# Altium project SOM Board with RK3399.PrjPcb (part 4 of 5)

## Sheet [15]-Push_Button_&_SYS_LED.SchDoc: RK3399 SOM Board Design V1.0
size A4; Author: AVIRAL MISHRA; DocumentNumber: 17; SheetNumber: 17; SheetTotal: 21; PROJECT CODE: A_V1.0
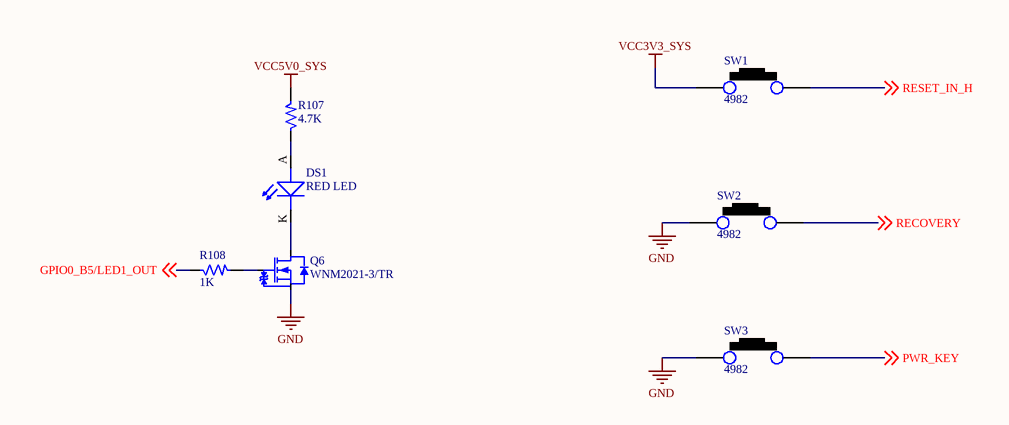
[diagram p16: [15]-Push_Button_&_SYS_LED.SchDoc]

### Parts
DS1  RED LED  [LED_0805]
Q6  WNM2021-3/TR  [SOT-323-3]
R107  4.7K  [RES_0402]
R108  1K  [RES_0402]
SW1  4982  [SW_177_39.3X77.7_SMD]
SW2  4982  [SW_177_39.3X77.7_SMD]
SW3  4982  [SW_177_39.3X77.7_SMD]

### Nets
GND: Q6.2(S) SW2.1 SW3.1
VCC3V3_SYS: SW1.1
VCC5V0_SYS: R107.2
GPIO0_B5/LED1_OUT: R108.1 ; off-sheet GPIO0_B5/LED1_OUT
PWR_KEY: SW3.2 ; off-sheet PWR_KEY
RECOVERY: SW2.2 ; off-sheet RECOVERY
RESET_IN_H: SW1.2 ; off-sheet RESET_IN_H
NetDS1_A: DS1.A(ANODE) R107.1
NetDS1_K: DS1.K(CATHODE) Q6.3(D)
NetQ6_1: Q6.1(G) R108.2

### Notes on the sheet
- TITLE:
- DOCUMENT NAME:
- SCALE 1:1
- This document is copyright of EsteemPCB and shall not be revealed, produced, copied, in whole or in part, nor
- PROJECT CODE:
- TEMPLATE:
- A4
- AUTHOR:
- Sheet
- of
- used for any purpose other than submitted.

### Library data of the parts
DS1 = LED_RED-2V-20mA-0805: Red 631nm LED Indication - Discrete 2V 0805 (2012 Metric); Manufacturer: Vishay Lite-On; Manufacturer Part Number: LTST-C171KRKT; Case/Package: 0805; Supplier-1: SP ROAD
Q6 = MOSFET-N_20V-820mA-SOT-323: N Channel 20V 820mA 850mV @ 250uA 310mΩ @ 550mA,4.5V 310mW SOT-323(SC-70) MOSFET RoHS /; Manufacturer: WILLSEMI(Will Semicon); Manufacturer Part Number: WNM2021-3/TR; Case/Package: SOT-323(SC-70); Supplier-1: LCSC
R107 = RES_4.7K-0.1W-1%-0402: 4.7 kOhms ±1% 0.1W, 1/10W Chip Resistor 0402 (1005 Metric) Automotive AEC-Q200 Thick Film /; Manufacturer: Panasonic Electronic Components; Manufacturer Part Number: ERJ-2RKF4701X; Case/Package: 0402; Supplier-1: Digikey
R108 = RES_1K-0.1W-1%-0402: 1 kOhms ±1% 0.1W, 1/10W Chip Resistor 0402 (1005 Metric) Anti-Sulfur Thin Film /; Manufacturer: Vishay Beyschlag/Draloric/BC Components; Manufacturer Part Number: MCS04020C1001FE000; Case/Package: 0402; Supplier-1: Digikey
SW1-SW3 = SW1_4982: Tactile Switch 3x4x2mm SMD 2-Pin; Manufacturer: NA; Manufacturer Part Number: NA; Case/Package: SMD; Supplier-1: Sunrom

## Sheet [16]-SP1_TYPEC_PWR_IN.SchDoc: RK3399 SOM Board Design V1.0
size A4; Author: AVIRAL MISHRA; DocumentNumber: 18; SheetNumber: 18; SheetTotal: 21; PROJECT CODE: A_V1.0
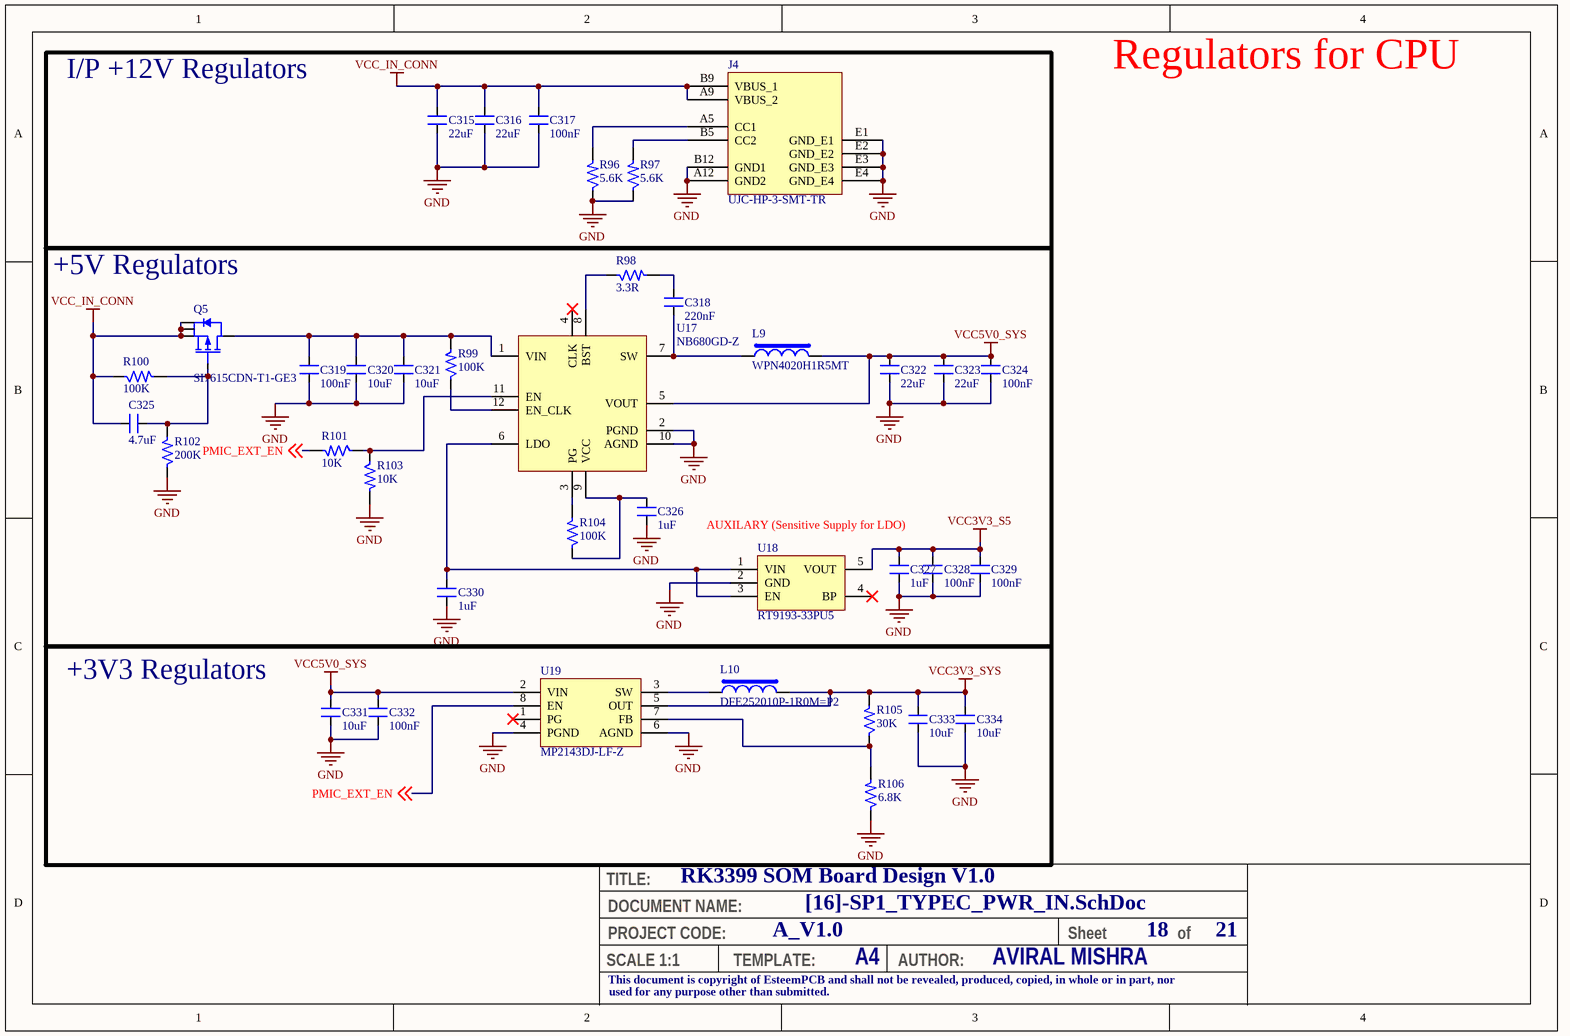
[diagram p17: [16]-SP1_TYPEC_PWR_IN.SchDoc]

### Parts
C315  22uF  [CAP_0603]
C316  22uF  [CAP_0603]
C317  100nF  [CAP_0402]
C318  220nF  [CAP_0402]
C319  100nF  [CAP_0402]
C320  10uF  [CAP_0402]
C321  10uF  [CAP_0402]
C322  22uF  [CAP_0603]
C323  22uF  [CAP_0603]
C324  100nF  [CAP_0402]
C325  4.7uF  [CAP_0402]
C326  1uF  [CAP_0402]
C327  1uF  [CAP_0402]
C328  100nF  [CAP_0402]
C329  100nF  [CAP_0402]
C330  1uF  [CAP_0402]
C331  10uF  [CAP_0402]
C332  100nF  [CAP_0402]
C333  10uF  [CAP_0402]
C334  10uF  [CAP_0402]
J4  UJC-HP-3-SMT-TR  [CON6_48.4_UJC-HP-3-SMT-TR]
L9  WPN4020H1R5MT  [IND_1616]
L10  DFE252010P-1R0M=P2  [IND_1008]
Q5  SI7615CDN-T1-GE3  [PowerPAK_1212-8_SMD]
R96  5.6K  [RES_0402]
R97  5.6K  [RES_0402]
R98  3.3R  [RES_0402]
R99  100K  [RES_0402]
R100  100K  [RES_0402]
R101  10K  [RES_0402]
R102  200K  [RES_0402]
R103  10K  [RES_0402]
R104  100K  [RES_0402]
R105  30K  [RES_0402]
R106  6.8K  [RES_0402]
U17  NB680GD-Z  [QFN-12_19_118X118_SMD]
U18  RT9193-33PU5  [SC70-5]
U19  MP2143DJ-LF-Z  [SOT23-8]

### Blocks framed on the sheet
I/P +12V Regulators: C315-C317 J4 R96 R97
+5V Regulators: C318-C330 L9 Q5 R98-R104 U17 U18
+3V3 Regulators: C331-C334 L10 R105 R106 U19

### Nets
GND: C315.1 C316.1 C317.1 C319.1 C320.1 C321.1 C322.1 C323.1 C324.1 C326.1 C327.1 C328.1 C329.1 C330.1 C331.1 C332.1 C333.1 C334.1 J4.A12(GND2) J4.B12(GND1) J4.E1(GND_E1) J4.E2(GND_E2) J4.E3(GND_E3) J4.E4(GND_E4) R96.1 R97.1 R102.1 R103.2 R106.1 U17.2(PGND) U17.10(AGND) U18.2(GND) U19.4(PGND) U19.6(AGND)
VCC3V3_S5: C327.2 C328.2 C329.2 U18.5(VOUT)
VCC3V3_SYS: C333.2 C334.2 L10.2 R105.2 U19.5(OUT)
VCC5V0_SYS: C322.2 C323.2 C324.2 C331.2 C332.2 L9.2 U17.5(VOUT) U19.2(VIN)
VCC_IN_CONN: C315.2 C316.2 C317.2 C325.1 J4.A9(VBUS_2) J4.B9(VBUS_1) Q5.1(S) Q5.2(S) Q5.3(S) R100.1
PMIC_EXT_EN: R101.2 U19.8(EN) ; off-sheet PMIC_EXT_EN
NetC318_1: C318.1 L9.1 U17.7(SW)
NetC318_2: C318.2 R98.2
NetC319_2: C319.2 C320.2 C321.2 Q5.5(D) R99.2 U17.1(VIN)
NetC325_2: C325.2 Q5.4(G) R100.2 R102.2
NetC326_2: C326.2 R104.1 U17.9(VCC)
NetC330_2: C330.2 U17.6(LDO) U18.1(VIN) U18.3(EN)
NetJ4_A5: J4.A5(CC1) R96.2
NetJ4_B5: J4.B5(CC2) R97.2
NetL10_1: L10.1 U19.3(SW)
NetR98_1: R98.1 U17.8(BST)
NetR99_1: R99.1 U17.12(EN_CLK)
NetR101_1: R101.1 R103.1 U17.11(EN)
NetR104_2: R104.2 U17.3(PG)
NetR105_1: R105.1 R106.2 U19.7(FB)

Not connected (* = marked no-connect by the designer): U17 4(CLK)*; U18 4(BP)*; U19 1(PG)*

### Notes on the sheet
- Regulators for CPU
- AUXILARY (Sensitive Supply for LDO)
- TITLE:
- DOCUMENT NAME:
- SCALE 1:1
- This document is copyright of EsteemPCB and shall not be revealed, produced, copied, in whole or in part, nor
- PROJECT CODE:
- TEMPLATE:
- A4
- AUTHOR:
- Sheet
- of
- used for any purpose other than submitted.

### Library data of the parts
C315 C316 C322 C323 = CAP_22uF-10V-20%-0603: 22µF ±20% 10V Ceramic Capacitor X5R 0603 (1608 Metric) /; Manufacturer: Murata Electronics; Manufacturer Part Number: GRM188R61A226ME15D; Case/Package: 0603; Supplier-1: Digikey
C317 C319 C324 C328 C329 C332 = CAP_100nF-25V-10%-0402: 0.1µF ±10% 25V Ceramic Capacitor X7R 0402 (1005 Metric) /; Manufacturer: Walsin Technology Corporation; Manufacturer Part Number: 0402B104K250CT; Case/Package: 0402; Supplier-1: Digikey
C318 = CAP_220nF-10V-10%-0402: 0.22µF ±10% 10V Ceramic Capacitor X7R 0402 (1005 Metric) /; Manufacturer: Samsung Electro-Mechanics; Manufacturer Part Number: CL05B224KP5NNNC; Case/Package: 0402; Supplier-1: Digikey
C320 C321 C331 C333 C334 = CAP_10uF-10V-20%-0402: 10µF ±20% 10V Ceramic Capacitor X5R 0402 (1005 Metric) /; Manufacturer Part Number: CL05A106MP5NUNC; Manufacturer: Samsung Electro-Mechanics; Case/Package: 0402; Supplier-1: Digikey
C325 = CAP_4.7uF-10V-10%-0402: 4.7µF ±10% 10V Ceramic Capacitor X5R 0402 (1005 Metric) /; Manufacturer: Samsung Electro-Mechanics; Manufacturer Part Number: CL05A475KP5NRNC; Case/Package: 0402; Supplier-1: Digikey
C326 C327 C330 = CAP_1uF-16V-10%-0402: 1µF ±10% 16V Ceramic Capacitor X5R 0402 (1005 Metric) /; Manufacturer: Knowles Novacap; Manufacturer Part Number: 0402BW105K160YT; Case/Package: 0402; Supplier-1: Digikey
J4 = CON-TYPEC_6X1-100-RA-TH: USB Connectors USB jack, C type, power only, 6 pin, horizonal, gold flash plating, surface mount, T&R; Manufacturer: CUI Devices; Manufacturer Part Number: UJC-HP-3-SMT-TR; Case/Package: TH; Supplier-1: Mouser
L9 = IND_1.5uH-6A-20%-SMD: Wire Wound SMD Power Inductors – WPN Series / Operating Temp. : -40℃~+125℃ (Including self-heating) /; Manufacturer: Sunlord; Mnaufcaturer Part Number: WPN4020H1R5MT; Case/Package: SMD; Supplier-1: NA
L10 = IND_1uH-3.8A-20%-1008: 1µH Shielded Wirewound Inductor 3.8A 54mOhm Max 1008 (2520 Metric) /; Manufacturer: Murata Electronics; Manufacturer Part Number: DFE252010P-1R0M=P2; Case/Package: 1008; Supplier-1: Digikey
Q5 = MOSFET-P_20V-35A-1212-8: P-Channel 20V 35A (Tc) 33W (Tc) Surface Mount PowerPAK® 1212-8 /; Manufacturer: Vishay Siliconix; Manufacturer Part Number: SI7615CDN-T1-GE3; Case/Package: PowerPAK® 1212-8; Supplier-1: Digikey
R96 R97 = RES_5.6K-0.1W-1%-0402: 5.6 kOhms ±1% 0.1W, 1/10W Chip Resistor 0402 (1005 Metric) Automotive AEC-Q200, Moisture Resistant Thick Film /; Manufacturer: KOA Speer Electronics, Inc.; Manufacturer Part Number: RK73H1ETTP5601F; Case/Package: 0402; Supplier-1: Digikey
R98 = RES_3.3R-0.1W-1%-0402: 3.3 Ohms ±1% 0.1W, 1/10W Chip Resistor 0402 (1005 Metric) Anti-Sulfur, Automotive AEC-Q200 Thick Film /; Manufacturer: Panasonic Electronic Components; Manufacturer Part Number: ERJ-U02F3R30X; Case/Package: 0402; Supplier-1: Digikey
R99 R100 R104 = RES_100K-0.1W-1%-0402: 100 kOhms ±1% 0.1W, 1/10W Chip Resistor 0402 (1005 Metric) Anti-Sulfur Thin Film /; Manufacturer: Vishay Beyschlag/Draloric/BC Components; Manufacturer Part Number: MCS04020C1003FE000; Case/Package: 0402; Supplier-1: Digikey
R101 R103 = RES_10K-0.1W-1%-0402: 10 kOhms ±1% 0.1W, 1/10W Chip Resistor 0402 (1005 Metric) Anti-Sulfur Thin Film /; Manufacturer: Vishay Beyschlag/Draloric/BC Components; Manufacturer Part Number: MCS04020C1002FE000; Case/Package: 0402; Supplier-1: Digikey
R102 = RES_200K-0.1W-1%-0402: 200 kOhms ±1% 0.1W, 1/10W Chip Resistor 0402 (1005 Metric) Automotive AEC-Q200 Thick Film /; Manufacturer: Panasonic Electronic Components; Manufacturer Part number: ERJ-2RKF2003X; Case/Package: 0402; Supplier-1: Digikey
R105 = RES_30K-0.1W-1%-0402: 30 kOhms ±1% 0.1W, 1/10W Chip Resistor 0402 (1005 Metric) Automotive AEC-Q200, Moisture Resistant Thick Film /; Manufacturer: KOA Speer Electronics, Inc.; Manufacturer Part Number: RK73H1ETTP3002F; Case/Package: 0402; Supplier-1: Digikey
R106 = RES_6.8K-0.1W-1%-0402: 6.8 kOhms ±1% 0.1W, 1/10W Chip Resistor 0402 (1005 Metric) Anti-Sulfur Thin Film /; Manufacturer Part Number: MCS04020C6801FE000; Manufacturer: Vishay Beyschlag/Draloric/BC Components; Case/Package: 0402; Supplier-1: Digikey
U17 = REG_3.3V-26V-8A-QFN-12: Switching Voltage Regulators 26V Fixed 3.3 V-8A Sync Buck Converter; Manufacturer: Monolithic Power Systems (MPS); Manufacturer Part Number: NB680GD-Z; Case/Package: QFN-12; Supplier-1: Mouser
U18 = REG_3.3V-5.5V-300mA-SC-70-5: SC-70-5 Dropout Regulators(LDO) RoHS; Manufacturer: Richtek Tech; Manufacturer Part Number: RT9193-33PU5; Case/Package: SC-70-5; Supplier-1: LCSC
U19 = REG_0.6~5V-5.5V-3A-TSOT-23-8: Switching Voltage Regulators 3A, 5.5V, 1.2MHz Sync Stp-Dwn Swtchr; Manufacturer: Monolithic Power Systems (MPS); Manufacturer Part Number: MP2143DJ-LF-Z; Case/Package: TSOT-23-8; Supplier-1: Mouser

## Sheet [17]-SP2_BUCKs_GPU_LOG_CPU-B.SchDoc: RK3399 SOM Board Design V1.0
size A3; Author: ABC; Organization: Altium Limited; Address1: L3, 12a Rodborough Rd; Address2: Frenchs Forest; Address3: NSW; Address4: Australia 2086; DocumentNumber: 19; SheetNumber: 19; SheetTotal: 21; PROJECT CODE: A_V1.0
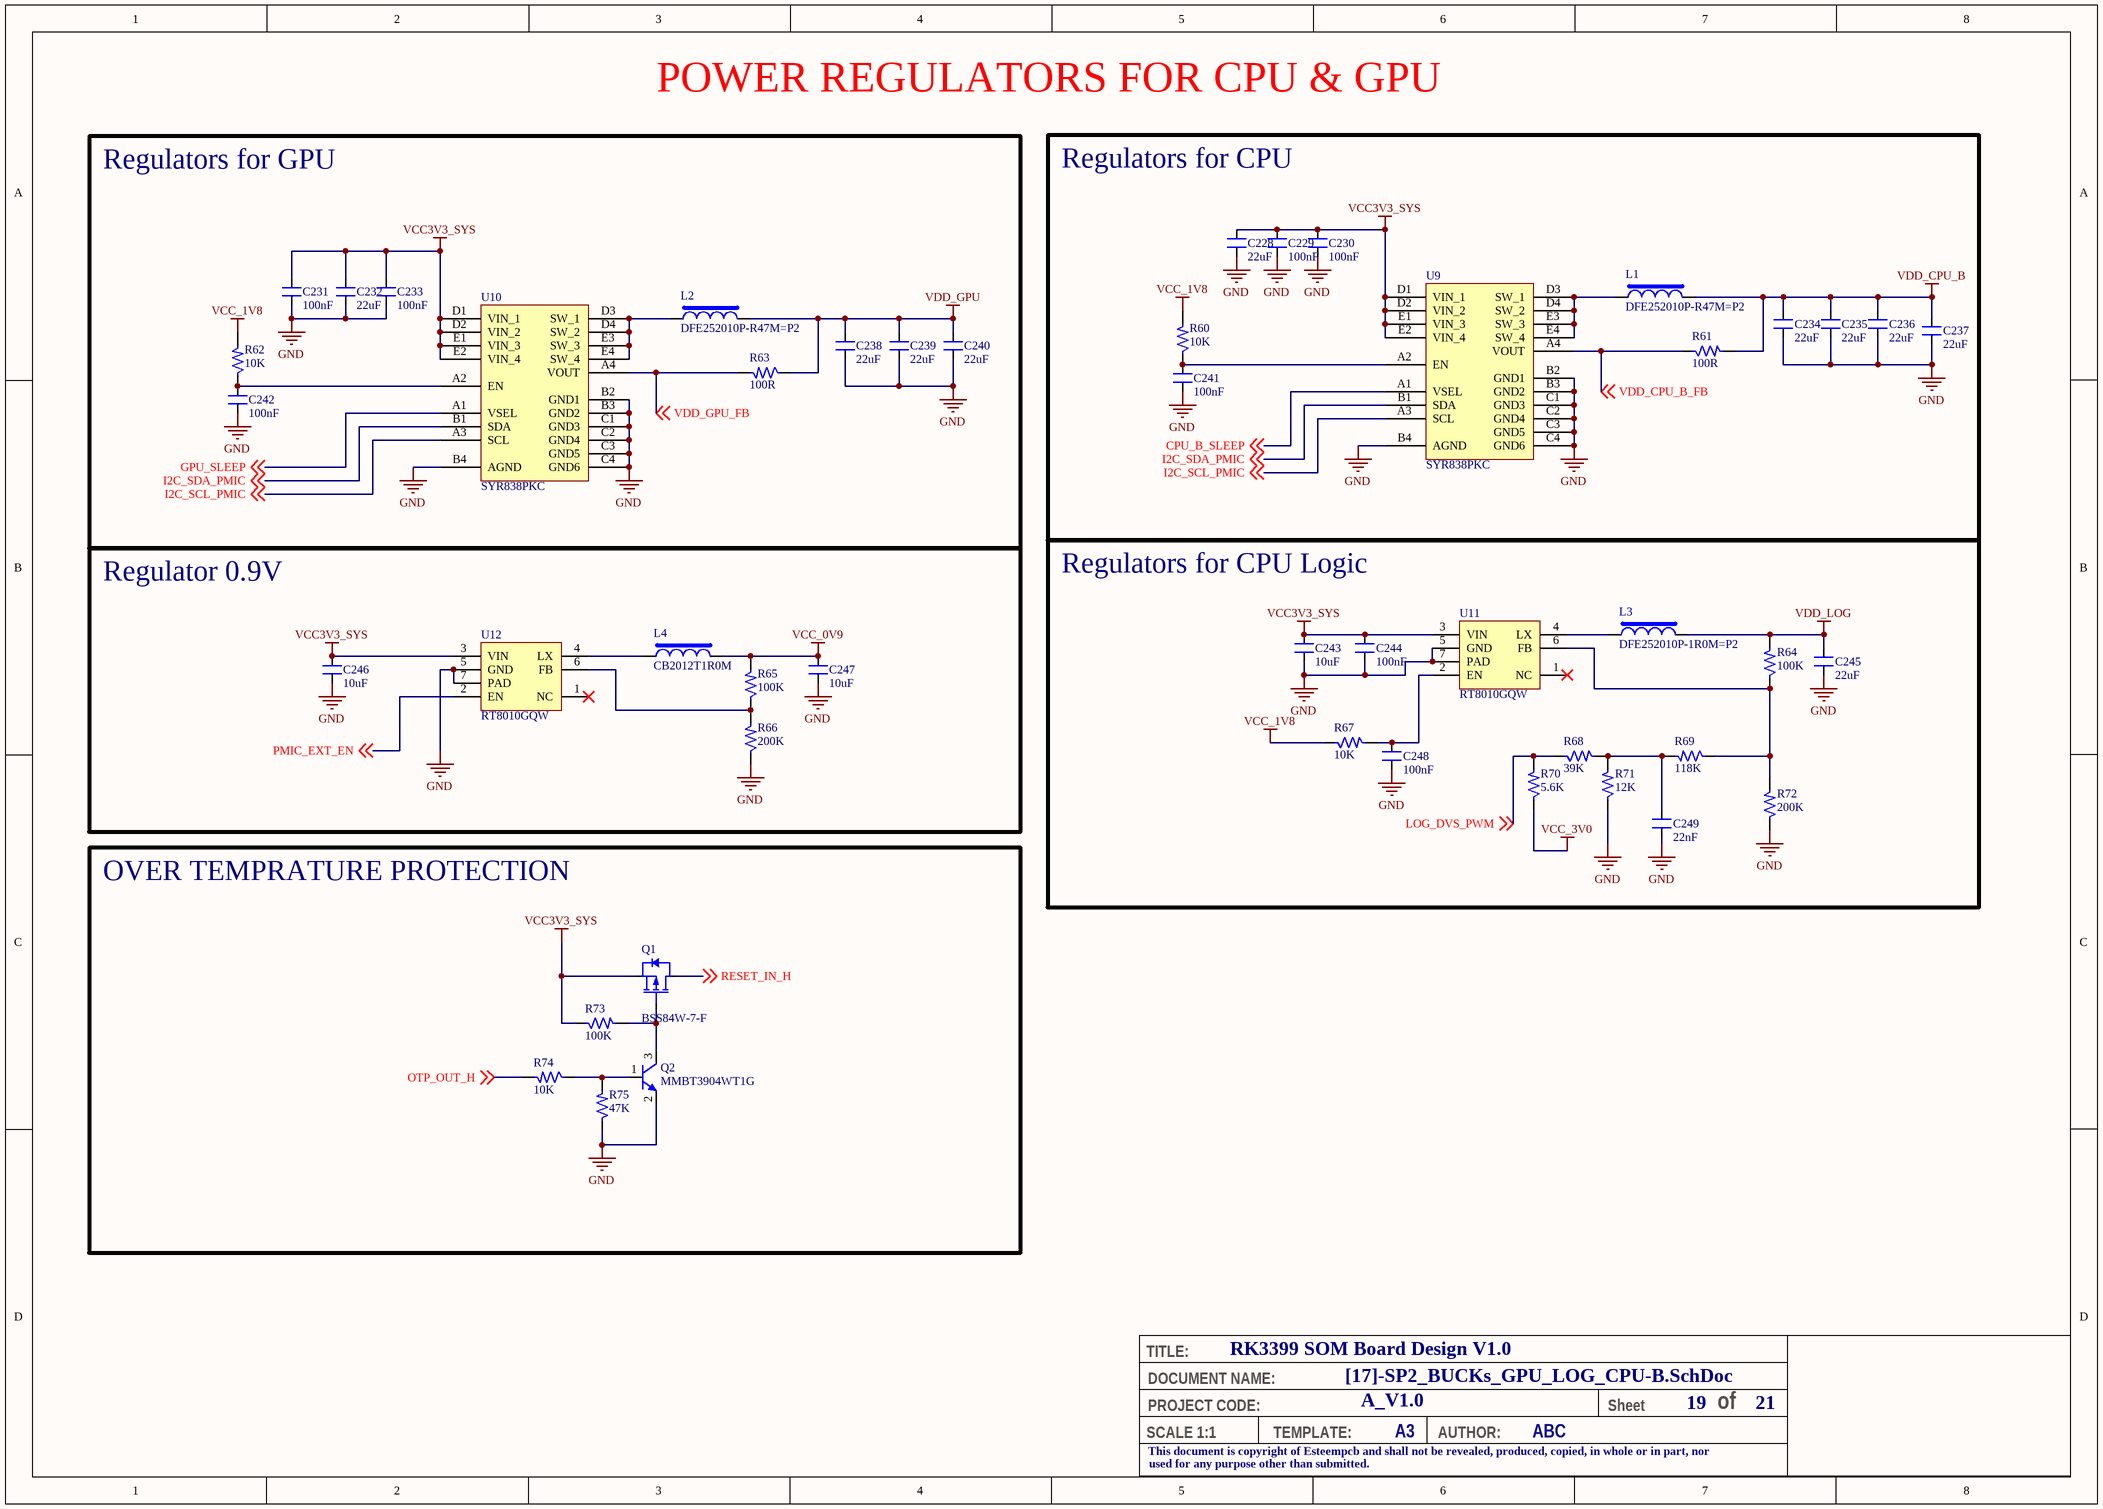
[diagram p18: [17]-SP2_BUCKs_GPU_LOG_CPU-B.SchDoc]

### Parts
C228  22uF  [CAP_0603]
C229  100nF  [CAP_0402]
C230  100nF  [CAP_0402]
C231  100nF  [CAP_0402]
C232  22uF  [CAP_0603]
C233  100nF  [CAP_0402]
C234  22uF  [CAP_0603]
C235  22uF  [CAP_0603]
C236  22uF  [CAP_0603]
C237  22uF  [CAP_0603]
C238  22uF  [CAP_0603]
C239  22uF  [CAP_0603]
C240  22uF  [CAP_0603]
C241  100nF  [CAP_0402]
C242  100nF  [CAP_0402]
C243  10uF  [CAP_0402]
C244  100nF  [CAP_0402]
C245  22uF  [CAP_0603]
C246  10uF  [CAP_0402]
C247  10uF  [CAP_0402]
C248  100nF  [CAP_0402]
C249  22nF  [CAP_0402]
L1  DFE252010P-R47M=P2  [IND_1008]
L2  DFE252010P-R47M=P2  [IND_1008]
L3  DFE252010P-1R0M=P2  [IND_1008]
L4  CB2012T1R0M  [IND_0805]
Q1  BSS84W-7-F  [SOT-323-3]
Q2  MMBT3904WT1G  [SOT-323-3]
R60  10K  [RES_0402]
R61  100R  [RES_0402]
R62  10K  [RES_0402]
R63  100R  [RES_0402]
R64  100K  [RES_0402]
R65  100K  [RES_0402]
R66  200K  [RES_0402]
R67  10K  [RES_0402]
R68  39K  [RES_0402]
R69  118K  [RES_0402]
R70  5.6K  [RES_0402]
R71  12K  [RES_0402]
R72  200K  [RES_0402]
R73  100K  [RES_0402]
R74  10K  [RES_0402]
R75  47K  [RES_0402]
U9  SYR838PKC  [CSP20_15.7_100x84_SMD]
U10  SYR838PKC  [CSP20_15.7_100x84_SMD]
U11  RT8010GQW  [WDFN-6_26_133X100_SMD]
U12  RT8010GQW  [WDFN-6_26_133X100_SMD]

### Blocks framed on the sheet
Regulators for GPU: C231-C233 C238-C240 C242 L2 R62 R63 U10
Regulators for CPU: C228-C230 C234-C237 C241 L1 R60 R61 U9
Regulator 0.9V: C246 C247 L4 R65 R66 U12
Regulators for CPU Logic: C243-C245 C248 C249 L3 R64 R67-R72 U11
OVER TEMPRATURE PROTECTION: Q1 Q2 R73-R75

### Nets
GND: C228.1 C229.1 C230.1 C231.1 C232.1 C233.1 C234.1 C235.1 C236.1 C237.1 C238.1 C239.1 C240.1 C241.1 C242.1 C243.1 C244.1 C245.1 C246.1 C247.1 C248.1 C249.1 Q2.2(E) R66.1 R71.1 R72.1 R75.1 U9.B2(GND1) U9.B3(GND2) U9.B4(AGND) U9.C1(GND3) U9.C2(GND4) U9.C3(GND5) U9.C4(GND6) U10.B2(GND1) U10.B3(GND2) U10.B4(AGND) U10.C1(GND3) U10.C2(GND4) U10.C3(GND5) U10.C4(GND6) U11.5(GND) U11.7(PAD) U12.5(GND) U12.7(PAD)
VCC3V3_SYS: C228.2 C229.2 C230.2 C231.2 C232.2 C233.2 C243.2 C244.2 C246.2 Q1.2(S) R73.1 U9.D1(VIN_1) U9.D2(VIN_2) U9.E1(VIN_3) U9.E2(VIN_4) U10.D1(VIN_1) U10.D2(VIN_2) U10.E1(VIN_3) U10.E2(VIN_4) U11.3(VIN) U12.3(VIN)
VCC_0V9: C247.2 L4.2 R65.2
VCC_1V8: R60.2 R62.2 R67.1
VCC_3V0: R70.1
VDD_CPU_B: C234.2 C235.2 C236.2 C237.2 L1.2 R61.2
VDD_GPU: C238.2 C239.2 C240.2 L2.2 R63.1
VDD_LOG: C245.2 L3.2 R64.2
CPU_B_SLEEP: U9.A1(VSEL) ; off-sheet CPU_B_SLEEP
GPU_SLEEP: U10.A1(VSEL) ; off-sheet GPU_SLEEP
I2C_SCL_PMIC: U9.A3(SCL) U10.A3(SCL) ; off-sheet I2C_SCL_PMIC
I2C_SDA_PMIC: U9.B1(SDA) U10.B1(SDA) ; off-sheet I2C_SDA_PMIC
LOG_DVS_PWM: R68.1 R70.2 ; off-sheet LOG_DVS_PWM
OTP_OUT_H: R74.2 ; off-sheet OTP_OUT_H
PMIC_EXT_EN: U12.2(EN) ; off-sheet PMIC_EXT_EN
RESET_IN_H: Q1.3(D) ; off-sheet RESET_IN_H
VDD_CPU_B_FB: R61.1 U9.A4(VOUT) ; off-sheet VDD_CPU_B_FB
VDD_GPU_FB: R63.2 U10.A4(VOUT) ; off-sheet VDD_GPU_FB
NetC241_2: C241.2 R60.1 U9.A2(EN)
NetC242_2: C242.2 R62.1 U10.A2(EN)
NetC248_2: C248.2 R67.2 U11.2(EN)
NetC249_2: C249.2 R68.2 R69.2 R71.2
NetL1_1: L1.1 U9.D3(SW_1) U9.D4(SW_2) U9.E3(SW_3) U9.E4(SW_4)
NetL2_1: L2.1 U10.D3(SW_1) U10.D4(SW_2) U10.E3(SW_3) U10.E4(SW_4)
NetL3_1: L3.1 U11.4(LX)
NetL4_1: L4.1 U12.4(LX)
NetQ1_1: Q1.1(G) Q2.3(C) R73.2
NetQ2_1: Q2.1(B) R74.1 R75.2
NetR64_1: R64.1 R69.1 R72.2 U11.6(FB)
NetR65_1: R65.1 R66.2 U12.6(FB)

Not connected (* = marked no-connect by the designer): U11 1(NC)*; U12 1(NC)*

### Notes on the sheet
- POWER REGULATORS FOR CPU & GPU
- TITLE:
- DOCUMENT NAME:
- SCALE 1:1
- This document is copyright of Esteempcb and shall not be revealed, produced, copied, in whole or in part, nor
- PROJECT CODE:
- TEMPLATE:
- A3
- AUTHOR:
- Sheet
- of
- used for any purpose other than submitted.

### Library data of the parts
C228 C232 C234-C240 C245 = CAP_22uF-10V-20%-0603: as C315 on sheet [16]-SP1_TYPEC_PWR_IN; Case/Package: 0603; Supplier-1: Digikey
C229-C231 C233 C241 C242 C244 C248 = CAP_100nF-25V-10%-0402: as C317 on sheet [16]-SP1_TYPEC_PWR_IN; Case/Package: 0402; Supplier-1: Digikey
C243 C246 C247 = CAP_10uF-10V-20%-0402: as C320 on sheet [16]-SP1_TYPEC_PWR_IN; Case/Package: 0402; Supplier-1: Digikey
C249 = CAP_22nF-10V-10%-0402: 0.022µF ±10% 10V Ceramic Capacitor X7R 0402 (1005 Metric) /; Manufacturer: Samsung Electro-Mechanics; Manufacturer Part Number: CL05B223KP5NNNC; Case/Package: 0402; Supplier-1: Digikey
L1 L2 = IND_470nH-5A-20%-1008: 470nH Shielded Wirewound Inductor 5A 35mOhm Max 1008 (2520 Metric); Manufacturer: Murata Electronics; Manufacturer Part Number: DFE252010P-R47M=P2; Case/Package: 1008; Supplier-1: Digikey
L3 = IND_1uH-3.8A-20%-1008: as L10 on sheet [16]-SP1_TYPEC_PWR_IN; Manufacturer Part Number: DFE252010P-1R0M=P2; Case/Package: 1008; Supplier-1: Digikey
L4 = IND_1uF-0.5A-20%-0805: 1uH ±20% 500mA 150mΩ 0805 Inductors (SMD) RoHS /; Manufacturer: Taiyo Yuden; Manufacturer Part Number: CB2012T1R0M; Case/Package: 0805; Supplier-1: LCSC
Q1 = MOSFET-P_50V-130mA-SOT-323: P-Channel 50V 130mA (Ta) 200mW (Ta) Surface Mount SOT-323; Manufacturer: Diodes Incorporated; Manufacturer Part Number: BSS84W-7-F; Case/Package: SOT-323; Supplier-1: Digikey
Q2 = TRNS-NPN_60V-0.2A-SOT323: Bipolar Transistors - BJT 200mA 60V NPN; Manufacturer: ON Semiconductor; Manufacturer Part Number: MMBT3904WT1G; Case/Package: SOT323; Supplier-1: Digikey
R60 R62 R67 R74 = RES_10K-0.1W-1%-0402: as R101 on sheet [16]-SP1_TYPEC_PWR_IN; Case/Package: 0402; Supplier-1: Digikey
R61 R63 = RES_100R-0.1W-1%-0402: 100 Ohms ±1% 0.1W, 1/10W Chip Resistor 0402 (1005 Metric) Automotive AEC-Q200, Moisture Resistant Thick Film /; Manufacturer: KOA Speer Electronics, Inc.; Manufacturer Part Number: RK73H1ETTP1000F; Case/Package: 0402; Supplier-1: Digikey
R64 R65 R73 = RES_100K-0.1W-1%-0402: as R99 on sheet [16]-SP1_TYPEC_PWR_IN; Case/Package: 0402; Supplier-1: Digikey
R66 R72 = RES_200K-0.1W-1%-0402: as R102 on sheet [16]-SP1_TYPEC_PWR_IN; Case/Package: 0402; Supplier-1: Digikey
R68 = RES_39K-0.1W-1%-0402: 39 kOhms ±1% 0.1W, 1/10W Chip Resistor 0402 (1005 Metric) Automotive AEC-Q200, Moisture Resistant Thick Film /; Manufacturer: KOA Speer Electronics, Inc.; Manufacturer Part Number: RK73H1ETTP3902F; Case/Package: 0402; Supplier-1: Digikey
R69 = RES_118K-0.1W-1%-0402: 118 kOhms ±1% 0.1W, 1/10W Chip Resistor 0402 (1005 Metric) Automotive AEC-Q200, Moisture Resistant Thick Film /; Manufacturer: KOA Speer Electronics, Inc.; Manuafcturer Part Number: RK73H1ETTP1183F; Case/Package: 0402; Supplier-1: Digikey
R70 = RES_5.6K-0.1W-1%-0402: as R96 on sheet [16]-SP1_TYPEC_PWR_IN; Case/Package: 0402; Supplier-1: Digikey
R71 = RES_12K-0.1W-1%-0402: 12 kOhms ±1% 0.1W, 1/10W Chip Resistor 0402 (1005 Metric) Anti-Sulfur Thin Film /; Manufacturer: Vishay Beyschlag/Draloric/BC Components; Manufacturer Part Number: MCS04020C1202FE000; Case/Package: 0402; Supplier-1: Digikey
R75 = RES_47K-0.1W-1%-0402: 47 kOhms ±1% 0.1W, 1/10W Chip Resistor 0402 (1005 Metric) Automotive AEC-Q200 Thick Film /; Manufacturer: Panasonic Electronic Components; Manufacturer Part Number: ERJ-2RKF4702X; Case/Package: 0402; Supplier-1: Digikey
U9 U10 = IC_SYR838PKC: Step-Down Positive Programmable 1 6A 2.4MHz CSP1.56*1.96-20 DC-DC Converters RoHS; Manufacturer: Silergy Corp; Manufacturer Part Number: SYR838PKC; Case/Package: CSP1.56*1.96-20; Supplier-1: LCSC
U11 U12 = REG-ADJ_5.5V-5.5V-1A-6-WDFN: Buck Switching Regulator IC Positive Adjustable 0.6V 1 Output 1A 6-WDFN Exposed Pad; Manufacturer: Richtek USA Inc.; Manufacturer Part Number: RT8010GQW; Case/Package: 6-WDFN; Supplier-1: Digikey

## Sheet [18]-SP3_PMIC_BLOCK.SchDoc: RK3399 SOM Board Design V1.0
size A3; Author: ABC; Organization: Altium Limited; Address1: L3, 12a Rodborough Rd; Address2: Frenchs Forest; Address3: NSW; Address4: Australia 2086; DocumentNumber: 20; SheetNumber: 20; SheetTotal: 21; PROJECT CODE: A_V1.0
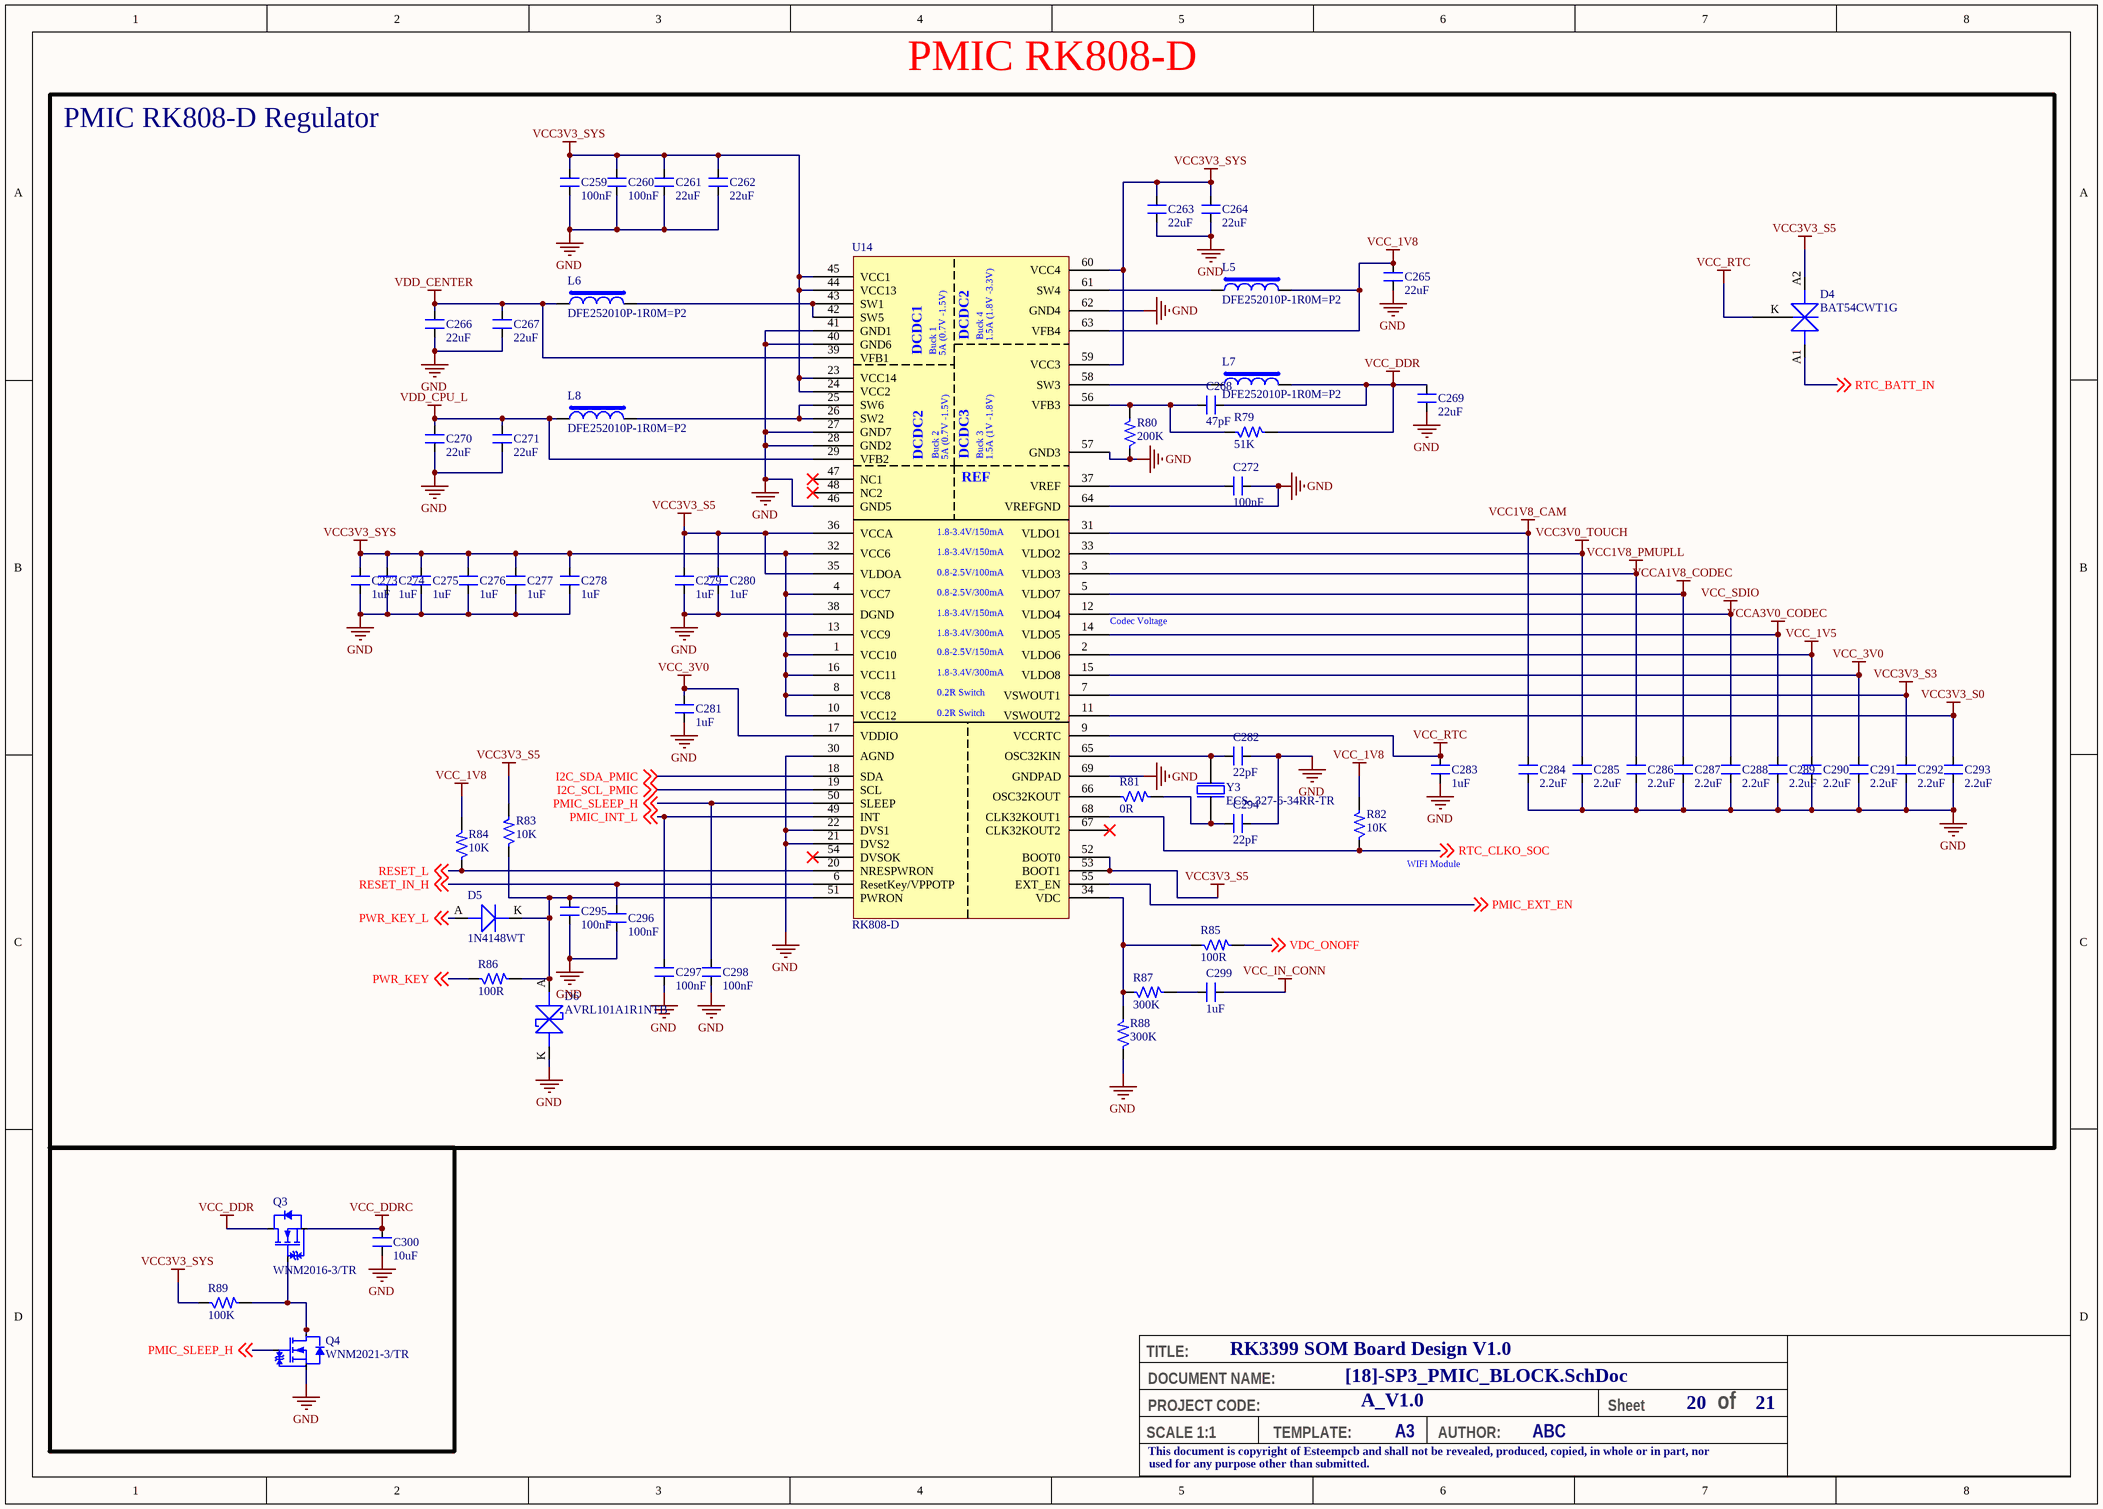
[diagram p19: [18]-SP3_PMIC_BLOCK.SchDoc]

### Parts
C259  100nF  [CAP_0402]
C260  100nF  [CAP_0402]
C261  22uF  [CAP_0603]
C262  22uF  [CAP_0603]
C263  22uF  [CAP_0603]
C264  22uF  [CAP_0603]
C265  22uF  [CAP_0603]
C266  22uF  [CAP_0603]
C267  22uF  [CAP_0603]
C268  47pF  [CAP_0402]
C269  22uF  [CAP_0603]
C270  22uF  [CAP_0603]
C271  22uF  [CAP_0603]
C272  100nF  [CAP_0402]
C273  1uF  [CAP_0402]
C274  1uF  [CAP_0402]
C275  1uF  [CAP_0402]
C276  1uF  [CAP_0402]
C277  1uF  [CAP_0402]
C278  1uF  [CAP_0402]
C279  1uF  [CAP_0402]
C280  1uF  [CAP_0402]
C281  1uF  [CAP_0402]
C282  22pF  [CAP_0402]
C283  1uF  [CAP_0402]
C284  2.2uF  [CAP_0402]
C285  2.2uF  [CAP_0402]
C286  2.2uF  [CAP_0402]
C287  2.2uF  [CAP_0402]
C288  2.2uF  [CAP_0402]
C289  2.2uF  [CAP_0402]
C290  2.2uF  [CAP_0402]
C291  2.2uF  [CAP_0402]
C292  2.2uF  [CAP_0402]
C293  2.2uF  [CAP_0402]
C294  22pF  [CAP_0402]
C295  100nF  [CAP_0402]
C296  100nF  [CAP_0402]
C297  100nF  [CAP_0402]
C298  100nF  [CAP_0402]
C299  1uF  [CAP_0402]
C300  10uF  [CAP_0402]
D4  BAT54CWT1G  [DIO_SOT-323-3]
D5  1N4148WT  [DIO_SOD523]
D6  AVRL101A1R1NTB  [DIO_0402_SMD]
L5  DFE252010P-1R0M=P2  [IND_1008]
L6  DFE252010P-1R0M=P2  [IND_1008]
L7  DFE252010P-1R0M=P2  [IND_1008]
L8  DFE252010P-1R0M=P2  [IND_1008]
Q3  WNM2016-3/TR  [SOT 23-3]
Q4  WNM2021-3/TR  [SOT-323-3]
R79  51K  [RES_0402]
R80  200K  [RES_0402]
R81  0R  [RES_0402]
R82  10K  [RES_0402]
R83  10K  [RES_0402]
R84  10K  [RES_0402]
R85  100R  [RES_0402]
R86  100R  [RES_0402]
R87  300K  [RES_0402]
R88  300K  [RES_0402]
R89  100K  [RES_0402]
U14  RK808-D  [QFN68_13.7_220.4X220.4_SMD]
Y3  ECS-.327-6-34RR-TR  [XTAL_ECS-.327-6-34RR-TR]

### Blocks framed on the sheet
PMIC RK808-D: C259-C299 D4-D6 L5-L8 R79-R88 U14 Y3

### Nets
GND: C259.1 C260.1 C261.1 C262.1 C263.1 C264.1 C265.1 C266.1 C267.1 C269.1 C270.1 C271.1 C272.1 C273.2 C274.1 C275.1 C276.1 C277.1 C278.1 C279.1 C280.1 C281.1 C282.2 C283.1 C284.1 C285.1 C286.1 C287.1 C288.1 C289.1 C290.1 C291.1 C292.1 C293.1 C294.2 C295.1 C296.1 C297.1 C298.1 C300.1 D6.K Q4.2(S) R80.1 R88.1 U14.21(DVS2) U14.22(DVS1) U14.27(GND7) U14.28(GND2) U14.30(AGND) U14.38(DGND) U14.40(GND6) U14.41(GND1) U14.46(GND5) U14.57(GND3) U14.62(GND4) U14.64(VREFGND) U14.69(GNDPAD)
VCC1V8_CAM: C284.2 U14.31(VLDO1)
VCC1V8_PMUPLL: C286.2 U14.3(VLDO3)
VCC3V0_TOUCH: C285.2 U14.33(VLDO2)
VCC3V3_S0: C293.2 U14.11(VSWOUT2)
VCC3V3_S3: C292.2 U14.7(VSWOUT1)
VCC3V3_S5: C279.2 C280.2 D4.A2 R83.2 U14.35(VLDOA) U14.36(VCCA) U14.52(BOOT0) U14.53(BOOT1)
VCC3V3_SYS: C259.2 C260.2 C261.2 C262.2 C263.2 C264.2 C273.1 C274.2 C275.2 C276.2 C277.2 C278.2 R89.1 U14.1(VCC10) U14.4(VCC7) U14.8(VCC8) U14.10(VCC12) U14.13(VCC9) U14.16(VCC11) U14.23(VCC14) U14.24(VCC2) U14.32(VCC6) U14.44(VCC13) U14.45(VCC1) U14.59(VCC3) U14.60(VCC4)
VCC_1V5: C290.2 U14.2(VLDO6)
VCC_1V8: C265.2 L5.2 R82.2 R84.2 U14.63(VFB4)
VCC_3V0: C281.2 C291.2 U14.15(VLDO8) U14.17(VDDIO)
VCC_DDR: C268.2 C269.2 L7.2 Q3.3(D) R79.2
VCC_DDRC: C300.2 Q3.2(S)
VCC_IN_CONN: C299.1
VCC_RTC: C283.2 D4.K U14.9(VCCRTC)
VCC_SDIO: C288.2 U14.12(VLDO4)
VCCA1V8_CODEC: C287.2 U14.5(VLDO7)
VCCA3V0_CODEC: C289.2 U14.14(VLDO5)
VDD_CENTER: C266.2 C267.2 L6.1 U14.39(VFB1)
VDD_CPU_L: C270.2 C271.2 L8.1 U14.29(VFB2)
I2C_SCL_PMIC: U14.19(SCL) ; off-sheet I2C_SCL_PMIC
I2C_SDA_PMIC: U14.18(SDA) ; off-sheet I2C_SDA_PMIC
PMIC_EXT_EN: U14.55(EXT_EN) ; off-sheet PMIC_EXT_EN
PMIC_INT_L: C297.2 U14.49(INT) ; off-sheet PMIC_INT_L
PMIC_SLEEP_H: C298.2 Q4.1(G) U14.50(SLEEP) ; off-sheet PMIC_SLEEP_H
PWR_KEY: R86.1 ; off-sheet PWR_KEY
PWR_KEY_L: D5.A(ANODE) ; off-sheet PWR_KEY_L
RESET_IN_H: C296.2 U14.6(ResetKey/VPPOTP) ; off-sheet RESET_IN_H
RESET_L: R84.1 U14.20(NRESPWRON) ; off-sheet RESET_L
RTC_BATT_IN: D4.A1 ; off-sheet RTC_BATT_IN
RTC_CLKO_SOC: R82.1 U14.68(CLK32KOUT1) ; off-sheet RTC_CLKO_SOC
VDC_ONOFF: R85.2 ; off-sheet VDC_ONOFF
NetC268_1: C268.1 R79.1 R80.2 U14.56(VFB3)
NetC272_2: C272.2 U14.37(VREF)
NetC282_1: C282.1 U14.65(OSC32KIN) Y3.2
NetC294_1: C294.1 R81.2 Y3.1
NetC295_2: C295.2 D5.K(CATHODE) D6.A R83.1 R86.2 U14.51(PWRON)
NetC299_2: C299.2 R87.2
NetL5_1: L5.1 U14.61(SW4)
NetL6_2: L6.2 U14.42(SW5) U14.43(SW1)
NetL7_1: L7.1 U14.58(SW3)
NetL8_2: L8.2 U14.25(SW6) U14.26(SW2)
NetQ3_1: Q3.1(G) Q4.3(D) R89.2
NetR81_1: R81.1 U14.66(OSC32KOUT)
NetR85_1: R85.1 R87.1 R88.2 U14.34(VDC)

Not connected (* = marked no-connect by the designer): U14 47(NC1)* 48(NC2)* 54(DVSOK)* 67(CLK32KOUT2)*

### Notes on the sheet
- PMIC RK808-D Regulator
- (near U14) Codec Voltage
- (near R82) WIFI Module
- TITLE:
- DOCUMENT NAME:
- SCALE 1:1
- This document is copyright of Esteempcb and shall not be revealed, produced, copied, in whole or in part, nor
- PROJECT CODE:
- TEMPLATE:
- A3
- AUTHOR:
- Sheet
- of
- used for any purpose other than submitted.
- (in symbol IC_RK808-D-QFN68) DCDC2; Buck 4; 1.5A (1.8V -3.3V); DCDC1; Buck 1; 5A (0.7V -1.5V); Buck 2; DCDC3; Buck 3; 1.5A (1V -1.8V); REF; 1.8-3.4V/150mA; 0.8-2.5V/100mA; 0.8-2.5V/300mA; 1.8-3.4V/300mA; 0.8-2.5V/150mA; 0.2R Switch

### Library data of the parts
C259 C260 C272 C295-C298 = CAP_100nF-25V-10%-0402: as C317 on sheet [16]-SP1_TYPEC_PWR_IN; Case/Package: 0402; Supplier-1: Digikey
C261-C267 C269-C271 = CAP_22uF-10V-20%-0603: as C315 on sheet [16]-SP1_TYPEC_PWR_IN; Case/Package: 0603; Supplier-1: Digikey
C268 = CAP_47pF-10V-10%-0402: 47pF ±10% 10V Ceramic Capacitor C0G, NP0 0402 (1005 Metric) /; Manufacturer: KEMET; Manufacturer Part Number: C0402C470K8GAC7867; Case/Package: 0402; Supplier-1: Supplier-1
C273-C281 C283 C299 = CAP_1uF-16V-10%-0402: as C326 on sheet [16]-SP1_TYPEC_PWR_IN; Case/Package: 0402; Supplier-1: Digikey
C282 C294 = CAP_22pF-10V-10%-0402: 22pF ±10% 10V Ceramic Capacitor C0G, NP0 0402 (1005 Metric) /; Manufacturer: KEMET; Manufacturer Part Number: C0402C220K8GACTU; Case/Package: 0402; Supplier-1: Digikey
C284-C293 = CAP_2.2uF-10V-10%-0402: 2.2µF ±10% 10V Ceramic Capacitor X5R 0402 (1005 Metric) /; Manufacturer: Murata Electronics; Manufacturer Part Number: GRM155R61A225KE95D; Case/Package: 0402; Supplier-1: Digikey
C300 = CAP_10uF-10V-20%-0402: as C320 on sheet [16]-SP1_TYPEC_PWR_IN; Case/Package: 0402; Supplier-1: Digikey
D4 = DIO-S-A_30V-200mA-SOT-323: Diode Array 1 Pair Common Cathode Schottky 30V 200mA (DC) Surface Mount SC-70, SOT-323; Manufacturer: ON Semiconductor; Manufacturer Part Number: BAT54CWT1G; Case/Package: SOT323; Supplier-1: Digikey
D5 = DIO_75V-200mA-SOD-523F: Diode Standard 100V 300mA (DC) Surface Mount SOD-123; Manufacturer: FAIRCHILD; Manufacturer Part Number: 1N4148WT; Case/Package: SOD123; Supplier-1: SIRICOM
D6 = DIO-T_10V-39V-0402: 39V Varistor 1 Circuit Surface Mount, MLCV 0402 (1005 Metric); Manufacturer: TDK Corporation; Manufacturer Part Number: AVRL101A1R1NTB; Supplier-1: Digikey; Case/Package: 0402
L5-L8 = IND_1uH-3.8A-20%-1008: as L10 on sheet [16]-SP1_TYPEC_PWR_IN; Manufacturer Part Number: DFE252010P-1R0M=P2; Case/Package: 1008; Supplier-1: Digikey
Q3 = MOSFET-N_20V-2.9A-SOT-23: N Channel 20V 2.9A 1V @ 250uA 47mΩ @ 3.6A,4.5V 700mW SOT-23(SOT-23-3) MOSFET RoHS /; Manufacturer: WILLSEMI(Will Semicon); Manufacturer Part Number: WNM2016-3/TR; Case/Package: SOT-23(SOT-23-3); Supplier-1: LCSC
Q4 = MOSFET-N_20V-820mA-SOT-323: as Q6 on sheet [15]-Push_Button_&_SYS_LED; Manufacturer Part Number: WNM2021-3/TR; Case/Package: SOT-323(SC-70); Supplier-1: LCSC
R79 = RES_51K-0.1W-1%-0402: 51 kOhms ±1% 0.1W, 1/10W Chip Resistor 0402 (1005 Metric) Automotive AEC-Q200 Thick Film /; Manufacturer: Panasonic Electronic Components; Manufacturer Part Number: ERJ-2RKF5102X; Case/Package: 0402; Supplier-1: Digikey
R80 = RES_200K-0.1W-1%-0402: as R102 on sheet [16]-SP1_TYPEC_PWR_IN; Case/Package: 0402; Supplier-1: Digikey
R81 = RES_0R-0.1W-1%-0402: 0 Ohms Jumper 0.1W, 1/10W Chip Resistor 0402 (1005 Metric) Automotive AEC-Q200 Thick Film; Manufacturer: Panasonic Electronic Components; Manufacturer Part Number: ERJ-2GE0R00X; Case/Package: 0402; Supplier-1: Digikey
R82-R84 = RES_10K-0.1W-1%-0402: as R101 on sheet [16]-SP1_TYPEC_PWR_IN; Case/Package: 0402; Supplier-1: Digikey
R85 R86 = RES_100R-0.1W-1%-0402: as R61 on sheet [17]-SP2_BUCKs_GPU_LOG_CPU-B; Case/Package: 0402; Supplier-1: Digikey
R87 R88 = RES_300K-0.1W-1%-0402: 300 kOhms ±1% 0.1W, 1/10W Chip Resistor 0402 (1005 Metric) Automotive AEC-Q200 Thick Film /; Manufacturer: Panasonic Electronic Components; Manufacturer Part Number: ERJ-2RKF3003X; Case/Package: 0402; Supplier-1: Digikey
R89 = RES_100K-0.1W-1%-0402: as R99 on sheet [16]-SP1_TYPEC_PWR_IN; Case/Package: 0402; Supplier-1: Digikey
U14 = IC_RK808-D-QFN68: The RK808 is a complete power supply solution for Portable systems.; Manufacturer: Rockchip; Manufacturer Part Number: RK808-D; Case/Package: QFN68; Supplier-1: Rockchip
Y3 = XTAL_32.768Khz-22pF-SMD: 32.768kHz ±20ppm Crystal 12pF 80 kOhms 2-SMD, No Lead /; Manufacturer: Ecliptek; Manufacturer Part Number: ECS-.327-6-34RR-TR; Case/Package: 0603; Supplier-1: Digikey

## Sheet [19]-DDR4_260_PIN_CON.SchDoc: RK3399 SOM Board Design V1.0
size A3; Author: ABC; Organization: Altium Limited; Address1: L3, 12a Rodborough Rd; Address2: Frenchs Forest; Address3: NSW; Address4: Australia 2086; DocumentNumber: 21; SheetNumber: 21; SheetTotal: 21; PROJECT CODE: A_V1.0
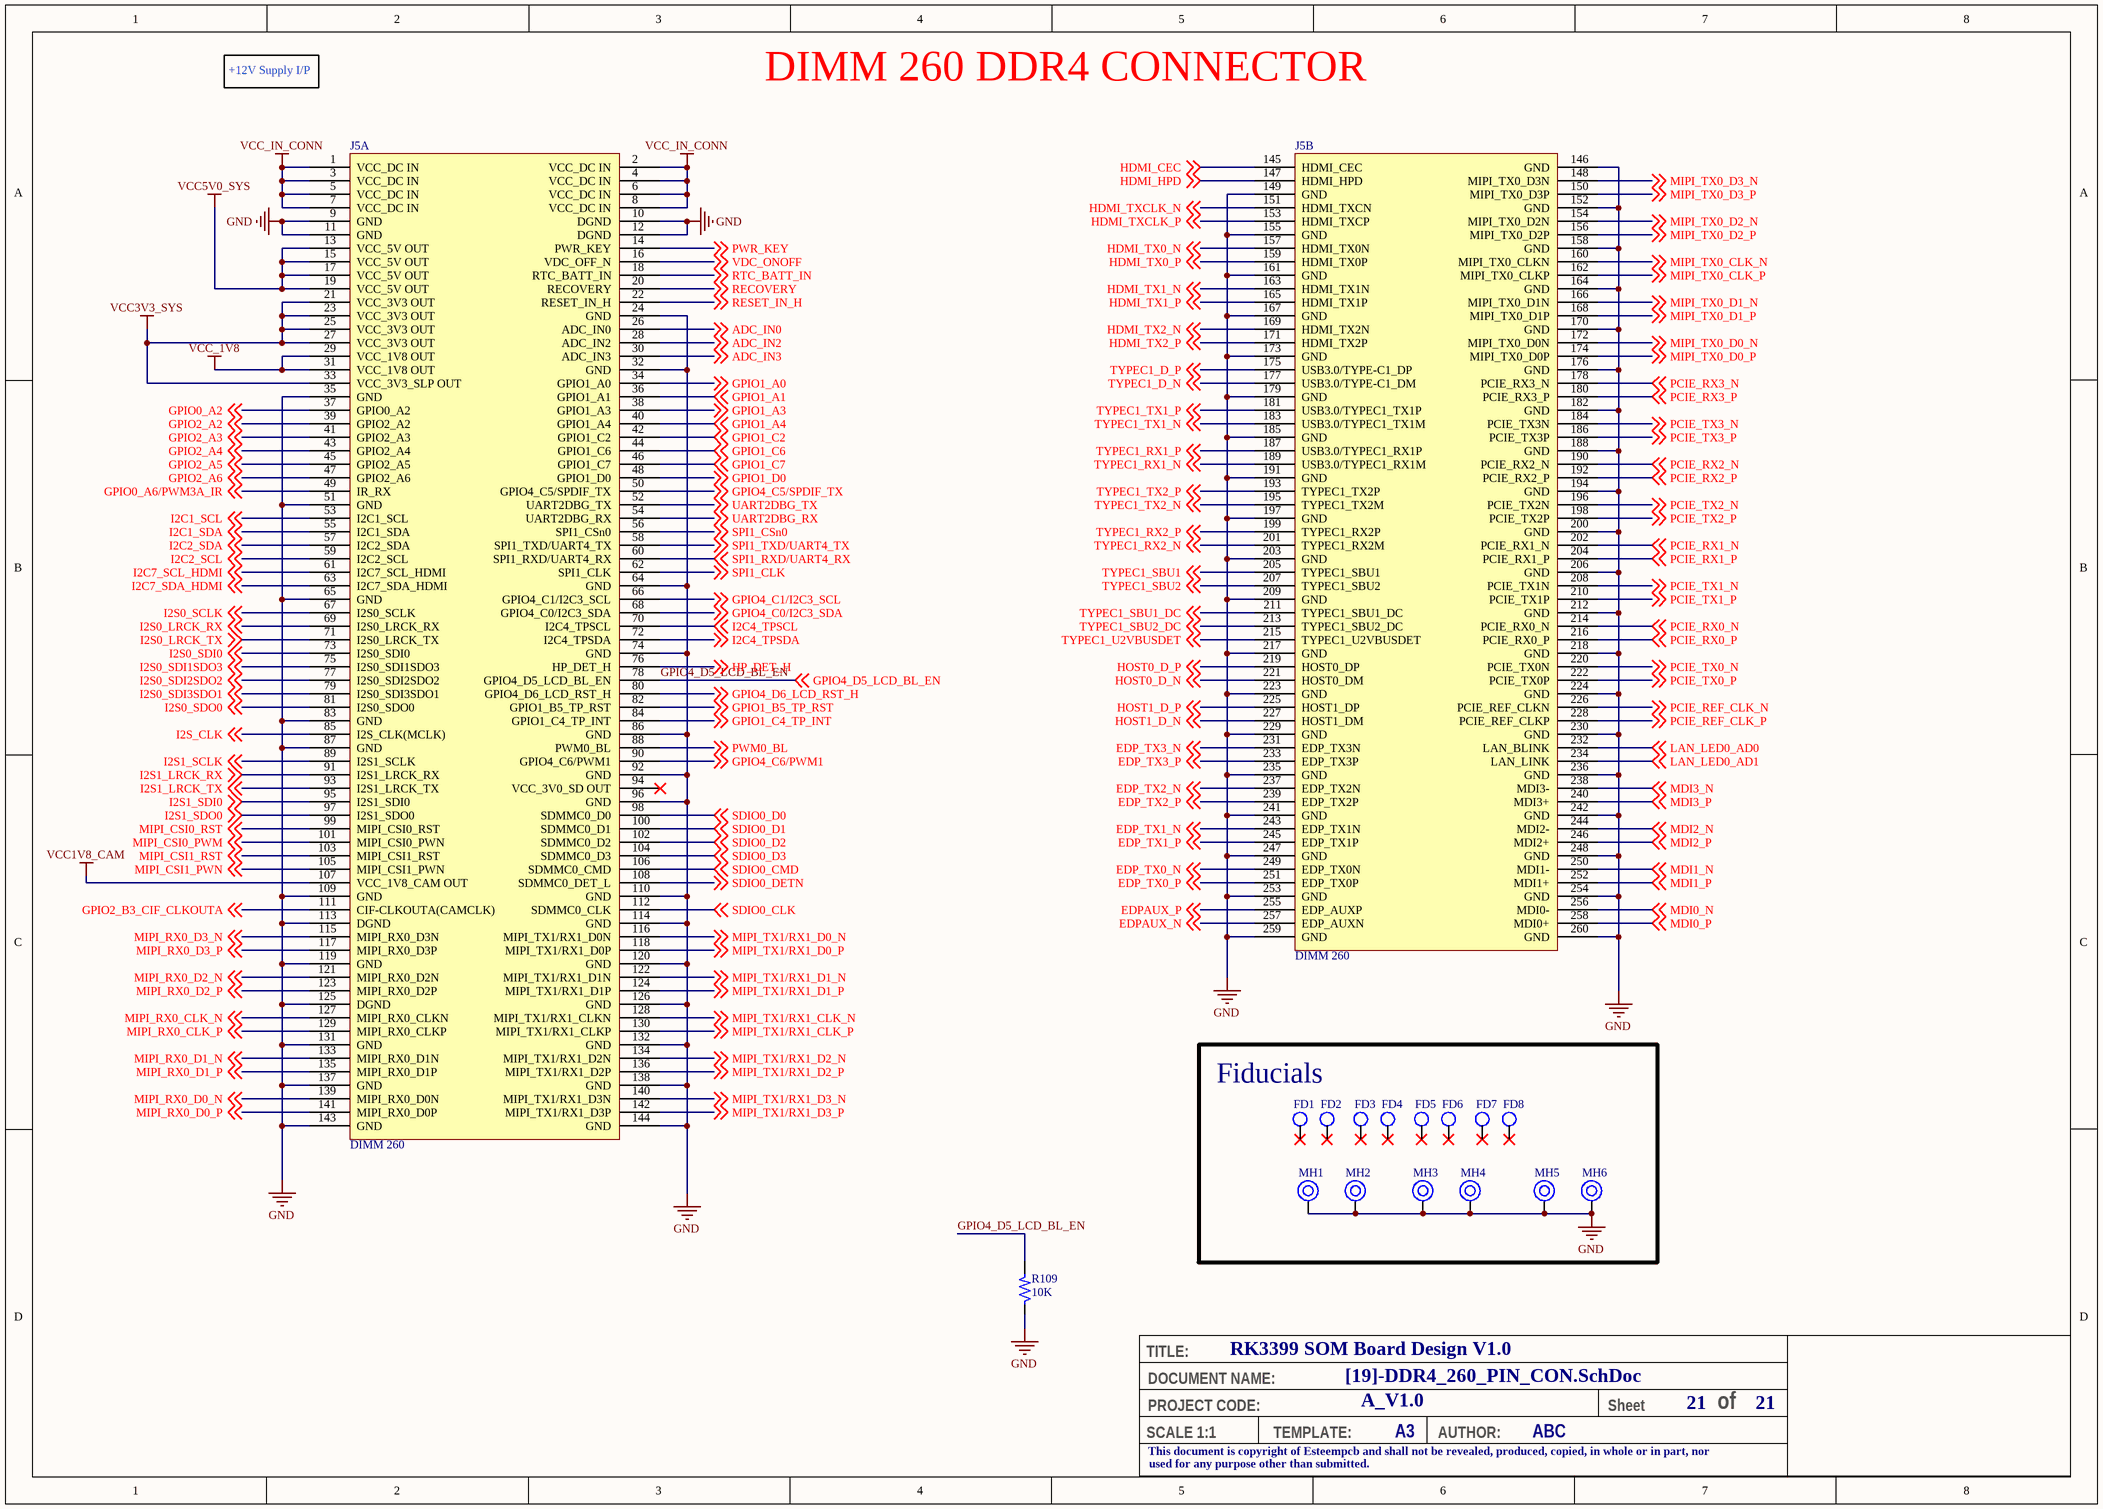
[diagram p20: [19]-DDR4_260_PIN_CON.SchDoc]

### Parts
FD1  Fiducial  [FIDUCIAL_50MIL]  (value not drawn)
FD2  Fiducial  [FIDUCIAL_50MIL]  (value not drawn)
FD3  Fiducial  [FIDUCIAL_50MIL]  (value not drawn)
FD4  Fiducial  [FIDUCIAL_50MIL]  (value not drawn)
FD5  Fiducial  [FIDUCIAL_50MIL]  (value not drawn)
FD6  Fiducial  [FIDUCIAL_50MIL]  (value not drawn)
FD7  Fiducial  [FIDUCIAL_50MIL]  (value not drawn)
FD8  Fiducial  [FIDUCIAL_50MIL]  (value not drawn)
J5  DIMM 260  [DIMM260_DDR4]  (parts A,B of 2)
MH1  Mounting Hole  [SOM_Mounting]  (value not drawn)  (no BOM)
MH2  Mounting Hole  [SOM_Mounting]  (value not drawn)  (no BOM)
MH3  Mounting Hole  [SOM_Mounting]  (value not drawn)  (no BOM)
MH4  Mounting Hole  [SOM_Mounting]  (value not drawn)  (no BOM)
MH5  Mounting Hole  [SOM_Mounting]  (value not drawn)  (no BOM)
MH6  Mounting Hole  [SOM_Mounting]  (value not drawn)  (no BOM)
R109  10K  [RES_0402]

### Blocks framed on the sheet
Fiducials: FD1-FD8 MH1-MH6

### Nets
GND: J5.9(GND) J5.10(DGND) J5.11(GND) J5.12(DGND) J5.24(GND) J5.32(GND) J5.35(GND) J5.51(GND) J5.64(GND) J5.65(GND) J5.74(GND) J5.83(GND) J5.86(GND) J5.87(GND) J5.92(GND) J5.96(GND) J5.109(GND) J5.110(GND) J5.113(DGND) J5.114(GND) J5.119(GND) J5.120(GND) J5.125(DGND) J5.126(GND) J5.131(GND) J5.132(GND) J5.137(GND) J5.138(GND) J5.143(GND) J5.144(GND) J5.146(GND) J5.149(GND) J5.152(GND) J5.155(GND) J5.158(GND) J5.161(GND) J5.164(GND) J5.167(GND) J5.170(GND) J5.173(GND) J5.176(GND) J5.179(GND) J5.182(GND) J5.185(GND) J5.188(GND) J5.191(GND) J5.194(GND) J5.197(GND) J5.200(GND) J5.203(GND) J5.206(GND) J5.209(GND) J5.212(GND) J5.217(GND) J5.218(GND) J5.223(GND) J5.224(GND) J5.229(GND) J5.230(GND) J5.235(GND) J5.236(GND) J5.241(GND) J5.242(GND) J5.247(GND) J5.248(GND) J5.253(GND) J5.254(GND) J5.259(GND) J5.260(GND) MH1.1 MH2.1 MH3.1 MH4.1 MH5.1 MH6.1 R109.1
VCC1V8_CAM: J5.107(VCC_1V8_CAM_OUT)
VCC3V3_SYS: J5.21(VCC_3V3_OUT) J5.23(VCC_3V3_OUT) J5.25(VCC_3V3_OUT) J5.27(VCC_3V3_OUT) J5.33(VCC_3V3_SLP_OUT)
VCC5V0_SYS: J5.13(VCC_5V_OUT) J5.15(VCC_5V_OUT) J5.17(VCC_5V_OUT) J5.19(VCC_5V_OUT)
VCC_1V8: J5.29(VCC_1V8_OUT) J5.31(VCC_1V8_OUT)
VCC_IN_CONN: J5.1(VCC_DC_IN) J5.2(VCC_DC_IN) J5.3(VCC_DC_IN) J5.4(VCC_DC_IN) J5.5(VCC_DC_IN) J5.6(VCC_DC_IN) J5.7(VCC_DC_IN) J5.8(VCC_DC_IN)
ADC_IN0: J5.26(ADC_IN0) ; off-sheet ADC_IN0
ADC_IN2: J5.28(ADC_IN2) ; off-sheet ADC_IN2
ADC_IN3: J5.30(ADC_IN3) ; off-sheet ADC_IN3
EDP_TX0_N: J5.249(EDP_TX0N) ; off-sheet EDP_TX0_N
EDP_TX0_P: J5.251(EDP_TX0P) ; off-sheet EDP_TX0_P
EDP_TX1_N: J5.243(EDP_TX1N) ; off-sheet EDP_TX1_N
EDP_TX1_P: J5.245(EDP_TX1P) ; off-sheet EDP_TX1_P
EDP_TX2_N: J5.237(EDP_TX2N) ; off-sheet EDP_TX2_N
EDP_TX2_P: J5.239(EDP_TX2P) ; off-sheet EDP_TX2_P
EDP_TX3_N: J5.231(EDP_TX3N) ; off-sheet EDP_TX3_N
EDP_TX3_P: J5.233(EDP_TX3P) ; off-sheet EDP_TX3_P
EDPAUX_N: J5.257(EDP_AUXN) ; off-sheet EDPAUX_N
EDPAUX_P: J5.255(EDP_AUXP) ; off-sheet EDPAUX_P
GPIO0_A2: J5.37(GPIO0_A2) ; off-sheet GPIO0_A2
GPIO0_A6/PWM3A_IR: J5.49(IR_RX) ; off-sheet GPIO0_A6/PWM3A_IR
GPIO1_A0: J5.34(GPIO1_A0) ; off-sheet GPIO1_A0
GPIO1_A1: J5.36(GPIO1_A1) ; off-sheet GPIO1_A1
GPIO1_A3: J5.38(GPIO1_A3) ; off-sheet GPIO1_A3
GPIO1_A4: J5.40(GPIO1_A4) ; off-sheet GPIO1_A4
GPIO1_B5_TP_RST: J5.82(GPIO1_B5_TP_RST) ; off-sheet GPIO1_B5_TP_RST
GPIO1_C2: J5.42(GPIO1_C2) ; off-sheet GPIO1_C2
GPIO1_C4_TP_INT: J5.84(GPIO1_C4_TP_INT) ; off-sheet GPIO1_C4_TP_INT
GPIO1_C6: J5.44(GPIO1_C6) ; off-sheet GPIO1_C6
GPIO1_C7: J5.46(GPIO1_C7) ; off-sheet GPIO1_C7
GPIO1_D0: J5.48(GPIO1_D0) ; off-sheet GPIO1_D0
GPIO2_A2: J5.39(GPIO2_A2) ; off-sheet GPIO2_A2
GPIO2_A3: J5.41(GPIO2_A3) ; off-sheet GPIO2_A3
GPIO2_A4: J5.43(GPIO2_A4) ; off-sheet GPIO2_A4
GPIO2_A5: J5.45(GPIO2_A5) ; off-sheet GPIO2_A5
GPIO2_A6: J5.47(GPIO2_A6) ; off-sheet GPIO2_A6
GPIO2_B3_CIF_CLKOUTA: J5.111(CIF-CLKOUTA(CAMCLK)) ; off-sheet GPIO2_B3_CIF_CLKOUTA
GPIO4_C0/I2C3_SDA: J5.68(GPIO4_C0/I2C3_SDA) ; off-sheet GPIO4_C0/I2C3_SDA
GPIO4_C1/I2C3_SCL: J5.66(GPIO4_C1/I2C3_SCL) ; off-sheet GPIO4_C1/I2C3_SCL
GPIO4_C5/SPDIF_TX: J5.50(GPIO4_C5/SPDIF_TX) ; off-sheet GPIO4_C5/SPDIF_TX
GPIO4_C6/PWM1: J5.90(GPIO4_C6/PWM1) ; off-sheet GPIO4_C6/PWM1
GPIO4_D5_LCD_BL_EN: J5.78(GPIO4_D5_LCD_BL_EN) R109.2 ; off-sheet GPIO4_D5_LCD_BL_EN
GPIO4_D6_LCD_RST_H: J5.80(GPIO4_D6_LCD_RST_H) ; off-sheet GPIO4_D6_LCD_RST_H
HDMI_CEC: J5.145(HDMI_CEC) ; off-sheet HDMI_CEC
HDMI_HPD: J5.147(HDMI_HPD) ; off-sheet HDMI_HPD
HDMI_TX0_N: J5.157(HDMI_TX0N) ; off-sheet HDMI_TX0_N
HDMI_TX0_P: J5.159(HDMI_TX0P) ; off-sheet HDMI_TX0_P
HDMI_TX1_N: J5.163(HDMI_TX1N) ; off-sheet HDMI_TX1_N
HDMI_TX1_P: J5.165(HDMI_TX1P) ; off-sheet HDMI_TX1_P
HDMI_TX2_N: J5.169(HDMI_TX2N) ; off-sheet HDMI_TX2_N
HDMI_TX2_P: J5.171(HDMI_TX2P) ; off-sheet HDMI_TX2_P
HDMI_TXCLK_N: J5.151(HDMI_TXCN) ; off-sheet HDMI_TXCLK_N
HDMI_TXCLK_P: J5.153(HDMI_TXCP) ; off-sheet HDMI_TXCLK_P
HOST0_D_N: J5.221(HOST0_DM) ; off-sheet HOST0_D_N
HOST0_D_P: J5.219(HOST0_DP) ; off-sheet HOST0_D_P
HOST1_D_N: J5.227(HOST1_DM) ; off-sheet HOST1_D_N
HOST1_D_P: J5.225(HOST1_DP) ; off-sheet HOST1_D_P
HP_DET_H: J5.76(HP_DET_H) ; off-sheet HP_DET_H
I2C1_SCL: J5.53(I2C1_SCL) ; off-sheet I2C1_SCL
I2C1_SDA: J5.55(I2C1_SDA) ; off-sheet I2C1_SDA
I2C2_SCL: J5.59(I2C2_SCL) ; off-sheet I2C2_SCL
I2C2_SDA: J5.57(I2C2_SDA) ; off-sheet I2C2_SDA
I2C4_TPSCL: J5.70(I2C4_TPSCL) ; off-sheet I2C4_TPSCL
I2C4_TPSDA: J5.72(I2C4_TPSDA) ; off-sheet I2C4_TPSDA
I2C7_SCL_HDMI: J5.61(I2C7_SCL_HDMI) ; off-sheet I2C7_SCL_HDMI
I2C7_SDA_HDMI: J5.63(I2C7_SDA_HDMI) ; off-sheet I2C7_SDA_HDMI
I2S0_LRCK_RX: J5.69(I2S0_LRCK_RX) ; off-sheet I2S0_LRCK_RX
I2S0_LRCK_TX: J5.71(I2S0_LRCK_TX) ; off-sheet I2S0_LRCK_TX
I2S0_SCLK: J5.67(I2S0_SCLK) ; off-sheet I2S0_SCLK
I2S0_SDI0: J5.73(I2S0_SDI0) ; off-sheet I2S0_SDI0
I2S0_SDI1SDO3: J5.75(I2S0_SDI1SDO3) ; off-sheet I2S0_SDI1SDO3
I2S0_SDI2SDO2: J5.77(I2S0_SDI2SDO2) ; off-sheet I2S0_SDI2SDO2
I2S0_SDI3SDO1: J5.79(I2S0_SDI3SDO1) ; off-sheet I2S0_SDI3SDO1
I2S0_SDO0: J5.81(I2S0_SDO0) ; off-sheet I2S0_SDO0
I2S1_LRCK_RX: J5.91(I2S1_LRCK_RX) ; off-sheet I2S1_LRCK_RX
I2S1_LRCK_TX: J5.93(I2S1_LRCK_TX) ; off-sheet I2S1_LRCK_TX
I2S1_SCLK: J5.89(I2S1_SCLK) ; off-sheet I2S1_SCLK
I2S1_SDI0: J5.95(I2S1_SDI0) ; off-sheet I2S1_SDI0
I2S1_SDO0: J5.97(I2S1_SDO0) ; off-sheet I2S1_SDO0
I2S_CLK: J5.85(I2S_CLK(MCLK)) ; off-sheet I2S_CLK
LAN_LED0_AD0: J5.232(LAN_BLINK) ; off-sheet LAN_LED0_AD0
LAN_LED0_AD1: J5.234(LAN_LINK) ; off-sheet LAN_LED0_AD1
MDI0_N: J5.256(MDI0-) ; off-sheet MDI0_N
MDI0_P: J5.258(MDI0+) ; off-sheet MDI0_P
MDI1_N: J5.250(MDI1-) ; off-sheet MDI1_N
MDI1_P: J5.252(MDI1+) ; off-sheet MDI1_P
MDI2_N: J5.244(MDI2-) ; off-sheet MDI2_N
MDI2_P: J5.246(MDI2+) ; off-sheet MDI2_P
MDI3_N: J5.238(MDI3-) ; off-sheet MDI3_N
MDI3_P: J5.240(MDI3+) ; off-sheet MDI3_P
MIPI_CSI0_PWM: J5.101(MIPI_CSI0_PWN) ; off-sheet MIPI_CSI0_PWM
MIPI_CSI0_RST: J5.99(MIPI_CSI0_RST) ; off-sheet MIPI_CSI0_RST
MIPI_CSI1_PWN: J5.105(MIPI_CSI1_PWN) ; off-sheet MIPI_CSI1_PWN
MIPI_CSI1_RST: J5.103(MIPI_CSI1_RST) ; off-sheet MIPI_CSI1_RST
MIPI_RX0_CLK_N: J5.127(MIPI_RX0_CLKN) ; off-sheet MIPI_RX0_CLK_N
MIPI_RX0_CLK_P: J5.129(MIPI_RX0_CLKP) ; off-sheet MIPI_RX0_CLK_P
MIPI_RX0_D0_N: J5.139(MIPI_RX0_D0N) ; off-sheet MIPI_RX0_D0_N
MIPI_RX0_D0_P: J5.141(MIPI_RX0_D0P) ; off-sheet MIPI_RX0_D0_P
MIPI_RX0_D1_N: J5.133(MIPI_RX0_D1N) ; off-sheet MIPI_RX0_D1_N
MIPI_RX0_D1_P: J5.135(MIPI_RX0_D1P) ; off-sheet MIPI_RX0_D1_P
MIPI_RX0_D2_N: J5.121(MIPI_RX0_D2N) ; off-sheet MIPI_RX0_D2_N
MIPI_RX0_D2_P: J5.123(MIPI_RX0_D2P) ; off-sheet MIPI_RX0_D2_P
MIPI_RX0_D3_N: J5.115(MIPI_RX0_D3N) ; off-sheet MIPI_RX0_D3_N
MIPI_RX0_D3_P: J5.117(MIPI_RX0_D3P) ; off-sheet MIPI_RX0_D3_P
MIPI_TX0_CLK_N: J5.160(MIPI_TX0_CLKN) ; off-sheet MIPI_TX0_CLK_N
MIPI_TX0_CLK_P: J5.162(MIPI_TX0_CLKP) ; off-sheet MIPI_TX0_CLK_P
MIPI_TX0_D0_N: J5.172(MIPI_TX0_D0N) ; off-sheet MIPI_TX0_D0_N
MIPI_TX0_D0_P: J5.174(MIPI_TX0_D0P) ; off-sheet MIPI_TX0_D0_P
MIPI_TX0_D1_N: J5.166(MIPI_TX0_D1N) ; off-sheet MIPI_TX0_D1_N
MIPI_TX0_D1_P: J5.168(MIPI_TX0_D1P) ; off-sheet MIPI_TX0_D1_P
MIPI_TX0_D2_N: J5.154(MIPI_TX0_D2N) ; off-sheet MIPI_TX0_D2_N
MIPI_TX0_D2_P: J5.156(MIPI_TX0_D2P) ; off-sheet MIPI_TX0_D2_P
MIPI_TX0_D3_N: J5.148(MIPI_TX0_D3N) ; off-sheet MIPI_TX0_D3_N
MIPI_TX0_D3_P: J5.150(MIPI_TX0_D3P) ; off-sheet MIPI_TX0_D3_P
MIPI_TX1/RX1_CLK_N: J5.128(MIPI_TX1/RX1_CLKN) ; off-sheet MIPI_TX1/RX1_CLK_N
MIPI_TX1/RX1_CLK_P: J5.130(MIPI_TX1/RX1_CLKP) ; off-sheet MIPI_TX1/RX1_CLK_P
MIPI_TX1/RX1_D0_N: J5.116(MIPI_TX1/RX1_D0N) ; off-sheet MIPI_TX1/RX1_D0_N
MIPI_TX1/RX1_D0_P: J5.118(MIPI_TX1/RX1_D0P) ; off-sheet MIPI_TX1/RX1_D0_P
MIPI_TX1/RX1_D1_N: J5.122(MIPI_TX1/RX1_D1N) ; off-sheet MIPI_TX1/RX1_D1_N
MIPI_TX1/RX1_D1_P: J5.124(MIPI_TX1/RX1_D1P) ; off-sheet MIPI_TX1/RX1_D1_P
MIPI_TX1/RX1_D2_N: J5.134(MIPI_TX1/RX1_D2N) ; off-sheet MIPI_TX1/RX1_D2_N
MIPI_TX1/RX1_D2_P: J5.136(MIPI_TX1/RX1_D2P) ; off-sheet MIPI_TX1/RX1_D2_P
MIPI_TX1/RX1_D3_N: J5.140(MIPI_TX1/RX1_D3N) ; off-sheet MIPI_TX1/RX1_D3_N
MIPI_TX1/RX1_D3_P: J5.142(MIPI_TX1/RX1_D3P) ; off-sheet MIPI_TX1/RX1_D3_P
PCIE_REF_CLK_N: J5.226(PCIE_REF_CLKN) ; off-sheet PCIE_REF_CLK_N
PCIE_REF_CLK_P: J5.228(PCIE_REF_CLKP) ; off-sheet PCIE_REF_CLK_P
PCIE_RX0_N: J5.214(PCIE_RX0_N) ; off-sheet PCIE_RX0_N
PCIE_RX0_P: J5.216(PCIE_RX0_P) ; off-sheet PCIE_RX0_P
PCIE_RX1_N: J5.202(PCIE_RX1_N) ; off-sheet PCIE_RX1_N
PCIE_RX1_P: J5.204(PCIE_RX1_P) ; off-sheet PCIE_RX1_P
PCIE_RX2_N: J5.190(PCIE_RX2_N) ; off-sheet PCIE_RX2_N
PCIE_RX2_P: J5.192(PCIE_RX2_P) ; off-sheet PCIE_RX2_P
PCIE_RX3_N: J5.178(PCIE_RX3_N) ; off-sheet PCIE_RX3_N
PCIE_RX3_P: J5.180(PCIE_RX3_P) ; off-sheet PCIE_RX3_P
PCIE_TX0_N: J5.220(PCIE_TX0N) ; off-sheet PCIE_TX0_N
PCIE_TX0_P: J5.222(PCIE_TX0P) ; off-sheet PCIE_TX0_P
PCIE_TX1_N: J5.208(PCIE_TX1N) ; off-sheet PCIE_TX1_N
PCIE_TX1_P: J5.210(PCIE_TX1P) ; off-sheet PCIE_TX1_P
PCIE_TX2_N: J5.196(PCIE_TX2N) ; off-sheet PCIE_TX2_N
PCIE_TX2_P: J5.198(PCIE_TX2P) ; off-sheet PCIE_TX2_P
PCIE_TX3_N: J5.184(PCIE_TX3N) ; off-sheet PCIE_TX3_N
PCIE_TX3_P: J5.186(PCIE_TX3P) ; off-sheet PCIE_TX3_P
PWM0_BL: J5.88(PWM0_BL) ; off-sheet PWM0_BL
PWR_KEY: J5.14(PWR_KEY) ; off-sheet PWR_KEY
RECOVERY: J5.20(RECOVERY) ; off-sheet RECOVERY
RESET_IN_H: J5.22(RESET_IN_H) ; off-sheet RESET_IN_H
RTC_BATT_IN: J5.18(RTC_BATT_IN) ; off-sheet RTC_BATT_IN
SDIO0_CLK: J5.112(SDMMC0_CLK) ; off-sheet SDIO0_CLK
SDIO0_CMD: J5.106(SDMMC0_CMD) ; off-sheet SDIO0_CMD
SDIO0_D0: J5.98(SDMMC0_D0) ; off-sheet SDIO0_D0
SDIO0_D1: J5.100(SDMMC0_D1) ; off-sheet SDIO0_D1
SDIO0_D2: J5.102(SDMMC0_D2) ; off-sheet SDIO0_D2
SDIO0_D3: J5.104(SDMMC0_D3) ; off-sheet SDIO0_D3
SDIO0_DETN: J5.108(SDMMC0_DET_L) ; off-sheet SDIO0_DETN
SPI1_CLK: J5.62(SPI1_CLK) ; off-sheet SPI1_CLK
SPI1_CSn0: J5.56(SPI1_CSn0) ; off-sheet SPI1_CSn0
SPI1_RXD/UART4_RX: J5.60(SPI1_RXD/UART4_RX) ; off-sheet SPI1_RXD/UART4_RX
SPI1_TXD/UART4_TX: J5.58(SPI1_TXD/UART4_TX) ; off-sheet SPI1_TXD/UART4_TX
TYPEC1_D_N: J5.177(USB3.0/TYPE-C1_DM) ; off-sheet TYPEC1_D_N
TYPEC1_D_P: J5.175(USB3.0/TYPE-C1_DP) ; off-sheet TYPEC1_D_P
TYPEC1_RX1_N: J5.189(USB3.0/TYPEC1_RX1M) ; off-sheet TYPEC1_RX1_N
TYPEC1_RX1_P: J5.187(USB3.0/TYPEC1_RX1P) ; off-sheet TYPEC1_RX1_P
TYPEC1_RX2_N: J5.201(TYPEC1_RX2M) ; off-sheet TYPEC1_RX2_N
TYPEC1_RX2_P: J5.199(TYPEC1_RX2P) ; off-sheet TYPEC1_RX2_P
TYPEC1_SBU1: J5.205(TYPEC1_SBU1) ; off-sheet TYPEC1_SBU1
TYPEC1_SBU1_DC: J5.211(TYPEC1_SBU1_DC) ; off-sheet TYPEC1_SBU1_DC
TYPEC1_SBU2: J5.207(TYPEC1_SBU2) ; off-sheet TYPEC1_SBU2
TYPEC1_SBU2_DC: J5.213(TYPEC1_SBU2_DC) ; off-sheet TYPEC1_SBU2_DC
TYPEC1_TX1_N: J5.183(USB3.0/TYPEC1_TX1M) ; off-sheet TYPEC1_TX1_N
TYPEC1_TX1_P: J5.181(USB3.0/TYPEC1_TX1P) ; off-sheet TYPEC1_TX1_P
TYPEC1_TX2_N: J5.195(TYPEC1_TX2M) ; off-sheet TYPEC1_TX2_N
TYPEC1_TX2_P: J5.193(TYPEC1_TX2P) ; off-sheet TYPEC1_TX2_P
TYPEC1_U2VBUSDET: J5.215(TYPEC1_U2VBUSDET) ; off-sheet TYPEC1_U2VBUSDET
UART2DBG_RX: J5.54(UART2DBG_RX) ; off-sheet UART2DBG_RX
UART2DBG_TX: J5.52(UART2DBG_TX) ; off-sheet UART2DBG_TX
VDC_ONOFF: J5.16(VDC_OFF_N) ; off-sheet VDC_ONOFF

Not connected (* = marked no-connect by the designer): FD1 1*; FD2 1*; FD3 1*; FD4 1*; FD5 1*; FD6 1*; FD7 1*; FD8 1*; J5 94(VCC_3V0_SD_OUT)*

### Notes on the sheet
- +12V Supply I/P
- DIMM 260 DDR4 CONNECTOR
- TITLE:
- DOCUMENT NAME:
- SCALE 1:1
- This document is copyright of Esteempcb and shall not be revealed, produced, copied, in whole or in part, nor
- PROJECT CODE:
- TEMPLATE:
- A3
- AUTHOR:
- Sheet
- of
- used for any purpose other than submitted.

### Library data of the parts
FD1-FD8 = Fiducials: 78.7 or 50 mil Fiducials SMD; Manufacturer: NA; Manufacturer Part Number: NA; Case/Package: SMD; Supplier-1: NA; Supplier Part Number-1: NA; Alternate Part Number-1: NA; Category: Fiducial; Number of Pins: 1
J5 = CON-DIMM_260-SMD: Dimm 260 pin smd plating on pcb; Manufacturer: NA; Manufacturer Part Number: NA; Case/Package: NA; Supplier-1: NA
MH1-MH6 = MH_3.5H_6D: Manufacturer Part Number: NA; Case/Package: TH; Manufacturer: NA; Supplier-1: NA
R109 = RES_10K-0.1W-1%-0402: as R101 on sheet [16]-SP1_TYPEC_PWR_IN; Case/Package: 0402; Supplier-1: Digikey